# Altium project prototipo_blocos_emg_v1.PrjPcb
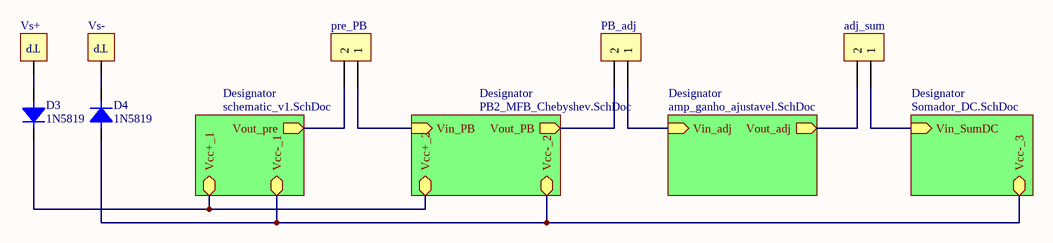
[diagram p0: not_sure_yet.SchDoc]
2 sheets, 15 parts. Net scope: hierarchical (ports join the sheet entries above them; power ports are global).
Board file: pcb_layout_v1.PcbDoc
Sheets:
  not_sure_yet.SchDoc
    Designator = Somador_DC.SchDoc

## Sheet not_sure_yet.SchDoc
size A4

### Parts
adj_sum  Header_1x2  [HDR-M-1x2-2.54mm-180-9.2mm]  (value not drawn)
D3  1N5819  [DO-41-Plastic]
D4  1N5819  [DO-41-Plastic]
PB_adj  Header_1x2  [HDR-M-1x2-2.54mm-180-9.2mm]  (value not drawn)
pre_PB  Header_1x2  [HDR-M-1x2-2.54mm-180-9.2mm]  (value not drawn)
Vs+  TestPoint  [TEST_POINT_PTH]  (value not drawn)
Vs-  TestPoint  [TEST_POINT_PTH]  (value not drawn)

### Sub-sheets
Designator = schematic_v1.SchDoc (file not in this document): Vout_pre (out), Vcc+_1, Vcc-_1
Designator = PB2_MFB_Chebyshev.SchDoc (file not in this document): Vin_PB (in), Vout_PB (out), Vcc+_2, Vcc-_2
Designator = Somador_DC.SchDoc: Vin_SumDC (in), Vcc-_3
Designator = amp_ganho_ajustavel.SchDoc (file not in this document): Vin_adj (in), Vout_adj (out)

### Nets
Netadj_sum_1: adj_sum.1 ; sheet Designator/Vin_SumDC
Netadj_sum_2: adj_sum.2 ; sheet Designator/Vout_adj
NetD3_A: D3.A Vs+.1(TP)
NetD3_K: D3.K ; sheet Designator/Vcc+_1, sheet Designator/Vcc+_2
NetD4_A: D4.A ; sheet Designator/Vcc-_1, sheet Designator/Vcc-_2, sheet Designator/Vcc-_3
NetD4_K: D4.K Vs-.1(TP)
NetPB_adj_1: PB_adj.1 ; sheet Designator/Vin_adj
NetPB_adj_2: PB_adj.2 ; sheet Designator/Vout_PB
Netpre_PB_1: pre_PB.1 ; sheet Designator/Vin_PB
Netpre_PB_2: pre_PB.2 ; sheet Designator/Vout_pre

### Library data of the parts
adj_sum PB_adj pre_PB = Header_1x2: Header, 1 Line, 2 Columns, 2 Pins; LatestRevisionDate: 17-Jul-2002; LatestRevisionNote: Re-released for DXP Platform.; Publisher: Altium Limited
D3 D4 = 1N4007: General Purpose Rectifier; Peak Repetitive Reverse Voltage (Vrrm): 1000 V; Forward Current (If): 1 A; Non-Repetitive Peak Forward Surge Current (Ifsm): 30 A; Forward Voltage (Vf): 1.1 V; Reverse Current (Ir): 5 uA; Total Capacitance (Ct): 15 pF
Vs+ Vs- = TestPoint: Test Point

## Sheet Somador_DC.SchDoc
size A4
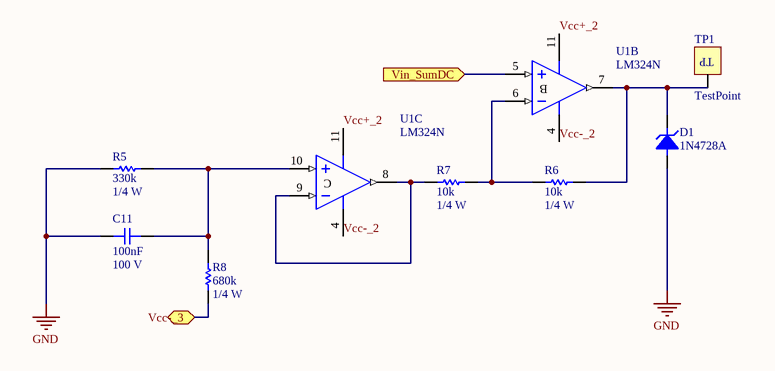
[diagram p1: Somador_DC.SchDoc]

### Parts
C11  100nF  Voltage: 100 V  [0805C]
D1  1N4728A  [DO-41-Glass]
R5  330k  Power: 1/4 W  [0805R]
R6  10k  Power: 1/4 W  [0805R]
R7  10k  Power: 1/4 W  [0805R]
R8  680k  Power: 1/4 W  [0805R]
TP1  TestPoint  [TEST_POINT_PTH]
U1  LM324N  [N014]  (parts B,C of 4)

### Ports
Vcc-_3, Vin_SumDC (in)

### Nets
GND: C11.2 D1.A R5.2
Vcc+_2: U1.11(V-)
Vcc-_2: U1.4(V+)
Netadj_sum_1: U1.5(IN+) ; port Vin_SumDC
NetC11_1: C11.1 R5.1 R8.2 U1.10(IN+)
NetD1_K: D1.K R6.2 TP1.1(TP) U1.7(OUT)
NetD4_A: R8.1 ; port Vcc-_3
NetR6_1: R6.1 R7.2 U1.6(IN-)
NetR7_1: R7.1 U1.8(OUT) U1.9(IN-)

### Notes on the sheet
- (in symbol LM324N, part B) B
- (in symbol LM324N, part C) C

### Library data of the parts
C11 = Capacitor: Published: 8-Jun-2000; LatestRevisionDate: 17-Jul-2002; LatestRevisionNote: Re-released for DXP Platform.; PackageReference: RAD-0.3; Publisher: Altium Limited
D1 = 1N4728A: Zener Diode; Zener Voltage (Vz): 3.3 V; Zener Current (Iz): 276 mA; Power Dissipation (Pd): 1.3 W; Forward Voltage (Vf): 1.2 V
R5-R8 = Resistor: Tolerance: 5%; Published: 8-Jun-2000; LatestRevisionDate: 17-Jul-2002; LatestRevisionNote: Re-released for DXP Platform.; PackageReference: AXIAL-0.3; Publisher: Altium Limited
TP1 = TestPoint: Test Point
U1 = LM324N: Quadruple Operational Amplifier; Published: 16-Jan-2001; LatestRevisionDate: 04-Mar-2005; LatestRevisionNote: Stylized 3D Model Added.; DatasheetVersion: Feb-1997; PackageVersion: Oct-1995; PackageReference: N014; Publisher: Altium Limited; PackageDescription: DIP; 14 Leads; Row Spacing 7.62 mm; Pitch 2.54 mm; ComponentLink1Description: Manufacturer Link; ComponentLink1URL: http://www.ti.com/; ComponentLink2Description: Datasheet; ComponentLink2URL: http://www-s.ti.com/sc/ds/lm324.pdf

## Nets that join several sheets
Netadj_sum_1: not_sure_yet (adj_sum.1), Somador_DC (U1.5)
NetD4_A: not_sure_yet (D4.A), Somador_DC (R8.1)